# Altium project PCB_EctoPortal.PrjPcb
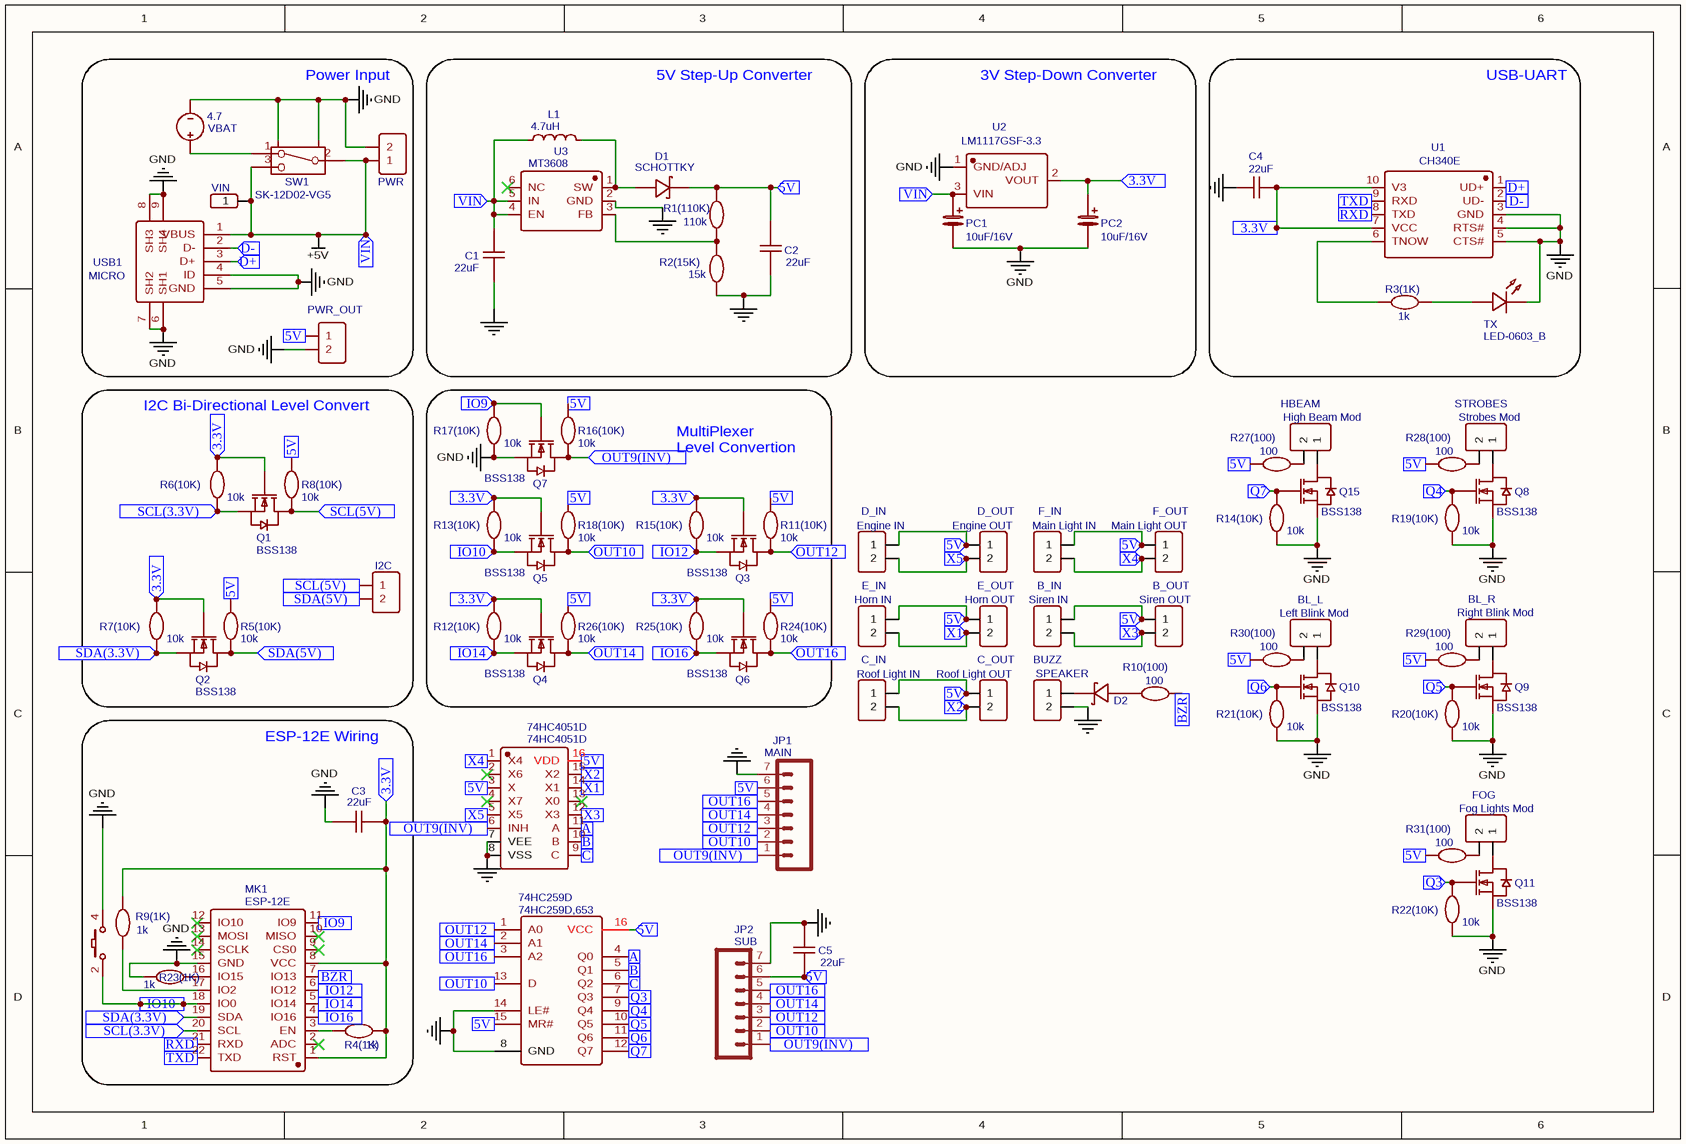
[diagram p0: PowerMod-ESP_2022-10-05.schdoc]
1 sheet, 86 parts. Net scope: flat (ports and power ports of the same name join across sheets).
Board file: 1-PCB_PCB_Ecto-1.pcbdoc

## Sheet PowerMod-ESP_2022-10-05.schdoc
size 315 x 213 mm; SheetNumber: 1; SheetTotal: 1

### Parts
74HC259D  74HC259D,653  [SOIC-16_L9.9-W3.9-P1.27-LS6.0-BL]
74HC4051D  74HC4051D  [SOIC-16_L9.9-W3.9-P1.27-LS6.0-BL]
B_IN  Siren IN  [JST_1.25MM_2P_SMD]
B_OUT  Siren OUT  [HDR-F-2.54_1X2]
BL_L  Left Blink Mod  [JST_1.25MM_2P_SMD]
BL_R  Right Blink Mod  [JST_1.25MM_2P_SMD]
BUZZ  SPEAKER  [HDR-F-2.54_1X2]
C1  22uF  [0805]
C2  22uF  [0805]
C3  22uF  [0805]
C4  22uF  [0805]
C5  22uF  [0805]
C_IN  Roof Light IN  [JST_1.25MM_2P_SMD]
C_OUT  Roof Light OUT  [HDR-F-2.54_1X2]
D1  SCHOTTKY  [SOD-123]
D2  SCTK  [SOD-123]  (value not drawn)
D_IN  Engine IN  [JST_1.25MM_2P_SMD]
D_OUT  Engine OUT  [HDR-F-2.54_1X2]
E_IN  Horn IN  [JST_1.25MM_2P_SMD]
E_OUT  Horn OUT  [HDR-F-2.54_1X2]
F_IN  Main Light IN  [JST_1.25MM_2P_SMD]
F_OUT  Main Light OUT  [HDR-F-2.54_1X2]
FLASH  K2-3.6×6.1_SMD  [SW-SMD_4P-L5.2-W5.2-P3.70-LS6.5]  (value not drawn)
FOG  Fog Lights Mod  [JST_1.25MM_2P_SMD]
HBEAM  High Beam Mod  [JST_1.25MM_2P_SMD]
I2C  HDR-F-2.54_1x2  [HDR-M-2.54_1X2]  (value not drawn)
JP1  MAIN  [1X07]
JP2  SUB  [JST_GH_SM07B-GHS-TB_07X1.25MM_ANGLED]
L1  4.7uH  [FXL0420]
MK1  ESP-12E  [WIFIM-SMD_ESP-12E]
PC1  10uF/16V  [CASE-A_3216]
PC2  10uF/16V  [CASE-A_3216]
PWR  HDR-F-2.54_1x2  [JST_1.25MM_2P_SMD]  (value not drawn)
PWR_OUT  HDR-F-2.54_1x2  [HDR-M-2.54_1X2]  (value not drawn)
Q1  BSS138  [SOT-23-3_L2.9-W1.6-P1.90-LS2.8-BR]
Q2  BSS138  [SOT-23-3_L2.9-W1.6-P1.90-LS2.8-BR]
Q3  BSS138  [SOT-23-3_L2.9-W1.6-P1.90-LS2.8-BR]
Q4  BSS138  [SOT-23-3_L2.9-W1.6-P1.90-LS2.8-BR]
Q5  BSS138  [SOT-23-3_L2.9-W1.6-P1.90-LS2.8-BR]
Q6  BSS138  [SOT-23-3_L2.9-W1.6-P1.90-LS2.8-BR]
Q7  BSS138  [SOT-23-3_L2.9-W1.6-P1.90-LS2.8-BR]
Q8  BSS138  [SOT-23-3_L2.9-W1.6-P1.90-LS2.8-BR]
Q9  BSS138  [SOT-23-3_L2.9-W1.6-P1.90-LS2.8-BR]
Q10  BSS138  [SOT-23-3_L2.9-W1.6-P1.90-LS2.8-BR]
Q11  BSS138  [SOT-23-3_L2.9-W1.6-P1.90-LS2.8-BR]
Q15  BSS138  [SOT-23-3_L2.9-W1.6-P1.90-LS2.8-BR]
R1(110K)  110k  [R0603]
R2(15K)  15k  [R0603]
R3(1K)  1k  [R0603]
R4(1K)  1k  [R0603]
R5(10K)  10k  [R0603]
R6(10K)  10k  [R0603]
R7(10K)  10k  [R0603]
R8(10K)  10k  [R0603]
R9(1K)  1k  [R0603]
R10(100)  100  [R0603]
R11(10K)  10k  [R0603]
R12(10K)  10k  [R0603]
R13(10K)  10k  [R0603]
R14(10K)  10k  [R0603]
R15(10K)  10k  [R0603]
R16(10K)  10k  [R0603]
R17(10K)  10k  [R0603]
R18(10K)  10k  [R0603]
R19(10K)  10k  [R0603]
R20(10K)  10k  [R0603]
R21(10K)  10k  [R0603]
R22(10K)  10k  [R0603]
R23(1K)  1k  [R0603]
R24(10K)  10k  [R0603]
R25(10K)  10k  [R0603]
R26(10K)  10k  [R0603]
R27(100)  100  [R0603]
R28(100)  100  [R0603]
R29(100)  100  [R0603]
R30(100)  100  [R0603]
R31(100)  100  [R0603]
STROBES  Strobes Mod  [JST_1.25MM_2P_SMD]
SW1  SK-12D02-VG5  [SW-TH_SK-12D02VG3]
TX  LED-0603_B  [LED0603_BLUE]
U1  CH340E  [MSOP-10_L3.0-W3.0-P0.50-LS5.0-BL]
U2  LM1117GSF-3.3  [SOT-223-3_L6.5-W3.4-P2.30-LS7.0-BR]
U3  MT3608  [SOT-23-6]
USB1  MICRO  [MICRO-USB-SMD_MICROXNJ]
VBAT  4.7  [JST_SH_SM02B-SRSS-TB_02X1.00MM_ANGLED]
VIN  HDR-M-2.54_1x1  [HDR-M-2.54_1X1]  (value not drawn)

### Blocks framed on the sheet
Power Input: PWR PWR_OUT SW1 USB1 VBAT VIN
5V Step-Up Converter: C1 C2 D1 L1 R1(110K) R2(15K) U3
3V Step-Down Converter: PC1 PC2 U2
USB-UART: C4 R3(1K) TX U1
I2C Bi-Directional Level Convert: I2C Q1 Q2 R5(10K) R6(10K) R7(10K) R8(10K)
ESP-12E Wiring: C3 FLASH MK1 R4(1K) R9(1K) R23(1K)

### Ports
3.3V (in, see PowerMod-ESP_2022-10-05[1B], PowerMod-ESP_2022-10-05[1C], PowerMod-ESP_2022-10-05[2B], PowerMod-ESP_2022-10-05[2C], PowerMod-ESP_2022-10-05[3B], PowerMod-ESP_2022-10-05[3C], PowerMod-ESP_2022-10-05[4A]), 3.3V (in, see PowerMod-ESP_2022-10-05[1B], PowerMod-ESP_2022-10-05[1C], PowerMod-ESP_2022-10-05[2B], PowerMod-ESP_2022-10-05[2C], PowerMod-ESP_2022-10-05[3B], PowerMod-ESP_2022-10-05[3C], PowerMod-ESP_2022-10-05[4A], PowerMod-ESP_2022-10-05[5A]), 3.3V (in, see PowerMod-ESP_2022-10-05[1B], PowerMod-ESP_2022-10-05[1C], PowerMod-ESP_2022-10-05[2B], PowerMod-ESP_2022-10-05[2C], PowerMod-ESP_2022-10-05[3B], PowerMod-ESP_2022-10-05[3C], PowerMod-ESP_2022-10-05[5A]), 3.3V (in, see PowerMod-ESP_2022-10-05[1B], PowerMod-ESP_2022-10-05[1C], PowerMod-ESP_2022-10-05[2B], PowerMod-ESP_2022-10-05[2C], PowerMod-ESP_2022-10-05[3B], PowerMod-ESP_2022-10-05[4A], PowerMod-ESP_2022-10-05[5A]), 3.3V (in, see PowerMod-ESP_2022-10-05[1B], PowerMod-ESP_2022-10-05[1C], PowerMod-ESP_2022-10-05[2B], PowerMod-ESP_2022-10-05[2C], PowerMod-ESP_2022-10-05[3C], PowerMod-ESP_2022-10-05[4A], PowerMod-ESP_2022-10-05[5A]), 3.3V (in, see PowerMod-ESP_2022-10-05[1B], PowerMod-ESP_2022-10-05[1C], PowerMod-ESP_2022-10-05[2C], PowerMod-ESP_2022-10-05[3B], PowerMod-ESP_2022-10-05[3C], PowerMod-ESP_2022-10-05[4A], PowerMod-ESP_2022-10-05[5A]), 3.3V (in, see PowerMod-ESP_2022-10-05[1B], PowerMod-ESP_2022-10-05[2B], PowerMod-ESP_2022-10-05[2C], PowerMod-ESP_2022-10-05[3B], PowerMod-ESP_2022-10-05[3C], PowerMod-ESP_2022-10-05[4A], PowerMod-ESP_2022-10-05[5A]), 3.3V (in, see PowerMod-ESP_2022-10-05[1C], PowerMod-ESP_2022-10-05[2B], PowerMod-ESP_2022-10-05[2C], PowerMod-ESP_2022-10-05[3B], PowerMod-ESP_2022-10-05[3C], PowerMod-ESP_2022-10-05[4A], PowerMod-ESP_2022-10-05[5A]), 5V (in, see PowerMod-ESP_2022-10-05[1B], PowerMod-ESP_2022-10-05[1C], PowerMod-ESP_2022-10-05[2B], PowerMod-ESP_2022-10-05[2C], PowerMod-ESP_2022-10-05[2D], PowerMod-ESP_2022-10-05[3A], PowerMod-ESP_2022-10-05[3B], PowerMod-ESP_2022-10-05[3C], PowerMod-ESP_2022-10-05[3D], PowerMod-ESP_2022-10-05[4B], PowerMod-ESP_2022-10-05[4C], PowerMod-ESP_2022-10-05[5B], PowerMod-ESP_2022-10-05[5C], PowerMod-ESP_2022-10-05[6B], PowerMod-ESP_2022-10-05[6C]), 5V (in, see PowerMod-ESP_2022-10-05[1B], PowerMod-ESP_2022-10-05[1C], PowerMod-ESP_2022-10-05[2B], PowerMod-ESP_2022-10-05[2C], PowerMod-ESP_2022-10-05[2D], PowerMod-ESP_2022-10-05[3A], PowerMod-ESP_2022-10-05[3B], PowerMod-ESP_2022-10-05[3C], PowerMod-ESP_2022-10-05[3D], PowerMod-ESP_2022-10-05[4B], PowerMod-ESP_2022-10-05[4C], PowerMod-ESP_2022-10-05[5B], PowerMod-ESP_2022-10-05[5C], PowerMod-ESP_2022-10-05[6B], PowerMod-ESP_2022-10-05[6C], PowerMod-ESP_2022-10-05[6D]), 5V (in, see PowerMod-ESP_2022-10-05[1B], PowerMod-ESP_2022-10-05[1C], PowerMod-ESP_2022-10-05[2B], PowerMod-ESP_2022-10-05[2C], PowerMod-ESP_2022-10-05[2D], PowerMod-ESP_2022-10-05[3A], PowerMod-ESP_2022-10-05[3B], PowerMod-ESP_2022-10-05[3C], PowerMod-ESP_2022-10-05[3D], PowerMod-ESP_2022-10-05[4B], PowerMod-ESP_2022-10-05[4C], PowerMod-ESP_2022-10-05[5B], PowerMod-ESP_2022-10-05[5C], PowerMod-ESP_2022-10-05[6B], PowerMod-ESP_2022-10-05[6D]), 5V (in, see PowerMod-ESP_2022-10-05[1B], PowerMod-ESP_2022-10-05[1C], PowerMod-ESP_2022-10-05[2B], PowerMod-ESP_2022-10-05[2C], PowerMod-ESP_2022-10-05[2D], PowerMod-ESP_2022-10-05[3A], PowerMod-ESP_2022-10-05[3B], PowerMod-ESP_2022-10-05[3C], PowerMod-ESP_2022-10-05[3D], PowerMod-ESP_2022-10-05[4B], PowerMod-ESP_2022-10-05[4C], PowerMod-ESP_2022-10-05[5B], PowerMod-ESP_2022-10-05[5C], PowerMod-ESP_2022-10-05[6C], PowerMod-ESP_2022-10-05[6D]), 5V (in, see PowerMod-ESP_2022-10-05[1B], PowerMod-ESP_2022-10-05[1C], PowerMod-ESP_2022-10-05[2B], PowerMod-ESP_2022-10-05[2C], PowerMod-ESP_2022-10-05[2D], PowerMod-ESP_2022-10-05[3A], PowerMod-ESP_2022-10-05[3B], PowerMod-ESP_2022-10-05[3C], PowerMod-ESP_2022-10-05[3D], PowerMod-ESP_2022-10-05[4B], PowerMod-ESP_2022-10-05[4C], PowerMod-ESP_2022-10-05[5B], PowerMod-ESP_2022-10-05[6B], PowerMod-ESP_2022-10-05[6C], PowerMod-ESP_2022-10-05[6D]), 5V (in, see PowerMod-ESP_2022-10-05[1B], PowerMod-ESP_2022-10-05[1C], PowerMod-ESP_2022-10-05[2B], PowerMod-ESP_2022-10-05[2C], PowerMod-ESP_2022-10-05[2D], PowerMod-ESP_2022-10-05[3A], PowerMod-ESP_2022-10-05[3B], PowerMod-ESP_2022-10-05[3C], PowerMod-ESP_2022-10-05[3D], PowerMod-ESP_2022-10-05[4B], PowerMod-ESP_2022-10-05[4C], PowerMod-ESP_2022-10-05[5C], PowerMod-ESP_2022-10-05[6B], PowerMod-ESP_2022-10-05[6C], PowerMod-ESP_2022-10-05[6D]), 5V (in, see PowerMod-ESP_2022-10-05[1B], PowerMod-ESP_2022-10-05[1C], PowerMod-ESP_2022-10-05[2B], PowerMod-ESP_2022-10-05[2C], PowerMod-ESP_2022-10-05[2D], PowerMod-ESP_2022-10-05[3B], PowerMod-ESP_2022-10-05[3C], PowerMod-ESP_2022-10-05[3D], PowerMod-ESP_2022-10-05[4B], PowerMod-ESP_2022-10-05[4C], PowerMod-ESP_2022-10-05[5B], PowerMod-ESP_2022-10-05[5C], PowerMod-ESP_2022-10-05[6B], PowerMod-ESP_2022-10-05[6C], PowerMod-ESP_2022-10-05[6D]), 5V (in, see PowerMod-ESP_2022-10-05[1B], PowerMod-ESP_2022-10-05[1C], PowerMod-ESP_2022-10-05[2B], PowerMod-ESP_2022-10-05[2C], PowerMod-ESP_2022-10-05[3A], PowerMod-ESP_2022-10-05[3B], PowerMod-ESP_2022-10-05[3C], PowerMod-ESP_2022-10-05[3D], PowerMod-ESP_2022-10-05[4B], PowerMod-ESP_2022-10-05[4C], PowerMod-ESP_2022-10-05[5B], PowerMod-ESP_2022-10-05[5C], PowerMod-ESP_2022-10-05[6B], PowerMod-ESP_2022-10-05[6C], PowerMod-ESP_2022-10-05[6D]), 5V (in, see PowerMod-ESP_2022-10-05[1B], PowerMod-ESP_2022-10-05[1C], PowerMod-ESP_2022-10-05[2B], PowerMod-ESP_2022-10-05[2D], PowerMod-ESP_2022-10-05[3A], PowerMod-ESP_2022-10-05[3B], PowerMod-ESP_2022-10-05[3C], PowerMod-ESP_2022-10-05[3D], PowerMod-ESP_2022-10-05[4B], PowerMod-ESP_2022-10-05[4C], PowerMod-ESP_2022-10-05[5B], PowerMod-ESP_2022-10-05[5C], PowerMod-ESP_2022-10-05[6B], PowerMod-ESP_2022-10-05[6C], PowerMod-ESP_2022-10-05[6D]), 5V (in, see PowerMod-ESP_2022-10-05[1B], PowerMod-ESP_2022-10-05[1C], PowerMod-ESP_2022-10-05[2C], PowerMod-ESP_2022-10-05[2D], PowerMod-ESP_2022-10-05[3A], PowerMod-ESP_2022-10-05[3B], PowerMod-ESP_2022-10-05[3C], PowerMod-ESP_2022-10-05[3D], PowerMod-ESP_2022-10-05[4B], PowerMod-ESP_2022-10-05[4C], PowerMod-ESP_2022-10-05[5B], PowerMod-ESP_2022-10-05[5C], PowerMod-ESP_2022-10-05[6B], PowerMod-ESP_2022-10-05[6C], PowerMod-ESP_2022-10-05[6D]), 5V (in, see PowerMod-ESP_2022-10-05[1B], PowerMod-ESP_2022-10-05[2B], PowerMod-ESP_2022-10-05[2C], PowerMod-ESP_2022-10-05[2D], PowerMod-ESP_2022-10-05[3A], PowerMod-ESP_2022-10-05[3B], PowerMod-ESP_2022-10-05[3C], PowerMod-ESP_2022-10-05[3D], PowerMod-ESP_2022-10-05[4B], PowerMod-ESP_2022-10-05[4C], PowerMod-ESP_2022-10-05[5B], PowerMod-ESP_2022-10-05[5C], PowerMod-ESP_2022-10-05[6B], PowerMod-ESP_2022-10-05[6C], PowerMod-ESP_2022-10-05[6D]), 5V (in, see PowerMod-ESP_2022-10-05[1C], PowerMod-ESP_2022-10-05[2B], PowerMod-ESP_2022-10-05[2C], PowerMod-ESP_2022-10-05[2D], PowerMod-ESP_2022-10-05[3A], PowerMod-ESP_2022-10-05[3B], PowerMod-ESP_2022-10-05[3C], PowerMod-ESP_2022-10-05[3D], PowerMod-ESP_2022-10-05[4B], PowerMod-ESP_2022-10-05[4C], PowerMod-ESP_2022-10-05[5B], PowerMod-ESP_2022-10-05[5C], PowerMod-ESP_2022-10-05[6B], PowerMod-ESP_2022-10-05[6C], PowerMod-ESP_2022-10-05[6D]), A (in, see PowerMod-ESP_2022-10-05[3C]), A (in, see PowerMod-ESP_2022-10-05[3D]), B (in, see PowerMod-ESP_2022-10-05[3C]), B (in, see PowerMod-ESP_2022-10-05[3D]), BZR (in, see PowerMod-ESP_2022-10-05[2D]), BZR (in, see PowerMod-ESP_2022-10-05[5C]), C (in, see PowerMod-ESP_2022-10-05[3D]), D+ (in, see PowerMod-ESP_2022-10-05[1A]), D+ (in, see PowerMod-ESP_2022-10-05[6A]), D- (in, see PowerMod-ESP_2022-10-05[1A]), D- (in, see PowerMod-ESP_2022-10-05[6A]), IO9 (in, see PowerMod-ESP_2022-10-05[2B]), IO9 (in, see PowerMod-ESP_2022-10-05[2D]), IO10 (in), IO10 (in, see PowerMod-ESP_2022-10-05[2B]), IO12 (in, see PowerMod-ESP_2022-10-05[2D]), IO12 (in, see PowerMod-ESP_2022-10-05[3B]), IO14 (in, see PowerMod-ESP_2022-10-05[2C]), IO14 (in, see PowerMod-ESP_2022-10-05[2D]), IO16 (in, see PowerMod-ESP_2022-10-05[2D]), IO16 (in, see PowerMod-ESP_2022-10-05[3C]), OUT9(INV) (in, see PowerMod-ESP_2022-10-05[2C], PowerMod-ESP_2022-10-05[3B], PowerMod-ESP_2022-10-05[3D]), OUT9(INV) (in, see PowerMod-ESP_2022-10-05[2C], PowerMod-ESP_2022-10-05[3D]), OUT9(INV) (in, see PowerMod-ESP_2022-10-05[3B], PowerMod-ESP_2022-10-05[3D]), OUT10 (in, see PowerMod-ESP_2022-10-05[2D], PowerMod-ESP_2022-10-05[3B], PowerMod-ESP_2022-10-05[3C]), OUT10 (in, see PowerMod-ESP_2022-10-05[2D], PowerMod-ESP_2022-10-05[3B], PowerMod-ESP_2022-10-05[3D]), OUT10 (in, see PowerMod-ESP_2022-10-05[2D], PowerMod-ESP_2022-10-05[3C], PowerMod-ESP_2022-10-05[3D]), OUT10 (in, see PowerMod-ESP_2022-10-05[3B], PowerMod-ESP_2022-10-05[3C], PowerMod-ESP_2022-10-05[3D]), OUT12 (in, see PowerMod-ESP_2022-10-05[2D], PowerMod-ESP_2022-10-05[3B], PowerMod-ESP_2022-10-05[3C]), OUT12 (in, see PowerMod-ESP_2022-10-05[2D], PowerMod-ESP_2022-10-05[3B], PowerMod-ESP_2022-10-05[3D]), OUT12 (in, see PowerMod-ESP_2022-10-05[2D], PowerMod-ESP_2022-10-05[3C], PowerMod-ESP_2022-10-05[3D]), OUT12 (in, see PowerMod-ESP_2022-10-05[3B], PowerMod-ESP_2022-10-05[3C], PowerMod-ESP_2022-10-05[3D]), OUT14 (in, see PowerMod-ESP_2022-10-05[2D], PowerMod-ESP_2022-10-05[3C]), OUT14 (in, see PowerMod-ESP_2022-10-05[2D], PowerMod-ESP_2022-10-05[3C], PowerMod-ESP_2022-10-05[3D]), OUT14 (in, see PowerMod-ESP_2022-10-05[3C], PowerMod-ESP_2022-10-05[3D]), OUT16 (in, see PowerMod-ESP_2022-10-05[2D], PowerMod-ESP_2022-10-05[3C]), OUT16 (in, see PowerMod-ESP_2022-10-05[2D], PowerMod-ESP_2022-10-05[3C], PowerMod-ESP_2022-10-05[3D]), OUT16 (in, see PowerMod-ESP_2022-10-05[3C], PowerMod-ESP_2022-10-05[3D]), Q3 (in, see PowerMod-ESP_2022-10-05[3D]), Q3 (in, see PowerMod-ESP_2022-10-05[6D]), Q4 (in, see PowerMod-ESP_2022-10-05[3D]), Q4 (in, see PowerMod-ESP_2022-10-05[6B]), Q5 (in, see PowerMod-ESP_2022-10-05[3D]), Q5 (in, see PowerMod-ESP_2022-10-05[6C]), Q6 (in, see PowerMod-ESP_2022-10-05[3D]), Q6 (in, see PowerMod-ESP_2022-10-05[5C]), Q7 (in, see PowerMod-ESP_2022-10-05[3D]), Q7 (in, see PowerMod-ESP_2022-10-05[5B]), RXD (in), RXD (in, see PowerMod-ESP_2022-10-05[5A]), SCL(3.3V) (in), SCL(3.3V) (in, see PowerMod-ESP_2022-10-05[1B]), SCL(5V) (in, see PowerMod-ESP_2022-10-05[1C]), SCL(5V) (in, see PowerMod-ESP_2022-10-05[2B]), SDA(3.3V) (in), SDA(3.3V) (in, see PowerMod-ESP_2022-10-05[1C]), SDA(5V) (in, see PowerMod-ESP_2022-10-05[1C]), TXD (in), TXD (in, see PowerMod-ESP_2022-10-05[5A]), VIN (in, see PowerMod-ESP_2022-10-05[2A]), VIN (in, see PowerMod-ESP_2022-10-05[2A], PowerMod-ESP_2022-10-05[4A]), X1 (in, see PowerMod-ESP_2022-10-05[3C]), X1 (in, see PowerMod-ESP_2022-10-05[4C]), X2 (in, see PowerMod-ESP_2022-10-05[3C]), X2 (in, see PowerMod-ESP_2022-10-05[4C]), X3 (in, see PowerMod-ESP_2022-10-05[3C]), X3 (in, see PowerMod-ESP_2022-10-05[4C]), X4 (in, see PowerMod-ESP_2022-10-05[2C]), X4 (in, see PowerMod-ESP_2022-10-05[4B]), X5 (in, see PowerMod-ESP_2022-10-05[2C]), X5 (in, see PowerMod-ESP_2022-10-05[4B])

### Nets
+5V: C1.2 L1.2 PC1.1 PWR.1 SW1.2 SW1.3 U2.3(VIN) U3.4(EN) U3.5(IN) USB1.1(VBUS) VIN.1 ; port VIN
GND: 74HC259D.8(GND) 74HC259D.14(LE#) 74HC4051D.7(VEE) 74HC4051D.8(VSS) BUZZ.2 C1.1 C2.1 C3.1 C4.2 C5.1 FLASH.4 JP1.7 JP2.7 MK1.15(GND) PC1.2 PC2.2 PWR.2 PWR_OUT.2 Q7.2(S) Q8.2(S) Q9.2(S) Q10.2(S) Q11.2(S) Q15.2(S) R2(15K).2 R14(10K).2 R17(10K).2 R19(10K).2 R20(10K).2 R21(10K).2 R22(10K).2 R23(1K).2 SW1.4 SW1.5 TX.2 U1.3(GND) U1.4(RTS#) U1.5(CTS#) U2.1(GND/ADJ) U3.2(GND) USB1.4(ID) USB1.5(GND) USB1.6(SH1) USB1.7(SH2) USB1.8(SH3) USB1.9(SH4) VBAT.2
Net74HC259D_1: 74HC259D.1(A0) JP1.3 JP2.3 Q3.3(D) R11(10K).2 ; port OUT12
Net74HC259D_2: 74HC259D.2(A1) JP1.4 JP2.4 Q4.3(D) R26(10K).2 ; port OUT14
Net74HC259D_3: 74HC259D.3(A2) JP1.5 JP2.5 Q6.3(D) R24(10K).2 ; port OUT16
Net74HC259D_4: 74HC259D.4(Q0) 74HC4051D.11(A) ; port A
Net74HC259D_5: 74HC259D.5(Q1) 74HC4051D.10(B) ; port B
Net74HC259D_6: 74HC259D.6(Q2) 74HC4051D.9(C) ; port C
Net74HC259D_7: 74HC259D.7(Q3) Q11.1(G) R22(10K).1 ; port Q3
Net74HC259D_9: 74HC259D.9(Q4) Q8.1(G) R19(10K).1 ; port Q4
Net74HC259D_10: 74HC259D.10(Q5) Q9.1(G) R20(10K).1 ; port Q5
Net74HC259D_11: 74HC259D.11(Q6) Q10.1(G) R21(10K).1 ; port Q6
Net74HC259D_12: 74HC259D.12(Q7) Q15.1(G) R14(10K).1 ; port Q7
Net74HC259D_13: 74HC259D.13(D) JP1.2 JP2.2 Q5.3(D) R18(10K).2 ; port OUT10
Net74HC259D_15: 74HC259D.15(MR#) 74HC259D.16(VCC) 74HC4051D.3(X) 74HC4051D.16(VDD) B_IN.1 B_OUT.1 C2.2 C5.2 C_IN.1 C_OUT.1 D1.2(K) D_IN.1 D_OUT.1 E_IN.1 E_OUT.1 F_IN.1 F_OUT.1 JP1.6 JP2.6 PWR_OUT.1 R1(110K).1 R5(10K).1 R8(10K).1 R11(10K).1 R16(10K).1 R18(10K).1 R24(10K).1 R26(10K).1 R27(100).1 R28(100).1 R29(100).1 R30(100).1 R31(100).1 ; port 5V
Net74HC4051D_1: 74HC4051D.1(X4) F_IN.2 F_OUT.2 ; port X4
Net74HC4051D_5: 74HC4051D.5(X5) D_IN.2 D_OUT.2 ; port X5
Net74HC4051D_6: 74HC4051D.6(INH) JP1.1 JP2.1 Q7.3(D) R16(10K).2 ; port OUT9(INV)
Net74HC4051D_12: 74HC4051D.12(X3) B_IN.2 B_OUT.2 ; port X3
Net74HC4051D_14: 74HC4051D.14(X1) E_IN.2 E_OUT.2 ; port X1
Net74HC4051D_15: 74HC4051D.15(X2) C_IN.2 C_OUT.2 ; port X2
NetBL_L_1: BL_L.1 Q10.3(D)
NetBL_L_2: BL_L.2 R30(100).2
NetBL_R_1: BL_R.1 Q9.3(D)
NetBL_R_2: BL_R.2 R29(100).2
NetBUZZ_1: BUZZ.1 D2.2(K)
NetC3_2: C3.2 C4.1 MK1.1(RST) MK1.8(VCC) PC2.1 Q1.1(G) Q2.1(G) Q3.1(G) Q4.1(G) Q5.1(G) Q6.1(G) R4(1K).2 R6(10K).1 R7(10K).1 R9(1K).2 R12(10K).1 R13(10K).1 R15(10K).1 R25(10K).1 U1.7(VCC) U1.10(V3) U2.2(VOUT) ; port 3.3V
NetD1_1: D1.1(A) L1.1 U3.1(SW)
NetD2_1: D2.1(A) R10(100).1
NetFLASH_2: FLASH.2 MK1.18(IO0) Q5.2(S) R13(10K).2 ; port IO10
NetFOG_1: FOG.1 Q11.3(D)
NetFOG_2: FOG.2 R31(100).2
NetHBEAM_1: HBEAM.1 Q15.3(D)
NetHBEAM_2: HBEAM.2 R27(100).2
NetI2C_1: I2C.1 Q1.3(D) R8(10K).2 ; port SCL(5V)
NetI2C_2: I2C.2 Q2.3(D) R5(10K).2 ; port SDA(5V)
NetMK1_3: MK1.3(EN) R4(1K).1
NetMK1_4: MK1.4(IO16) Q6.2(S) R25(10K).2 ; port IO16
NetMK1_5: MK1.5(IO14) Q4.2(S) R12(10K).2 ; port IO14
NetMK1_6: MK1.6(IO12) Q3.2(S) R15(10K).2 ; port IO12
NetMK1_7: MK1.7(IO13) R10(100).2 ; port BZR
NetMK1_11: MK1.11(IO9) Q7.1(G) R17(10K).1 ; port IO9
NetMK1_16: MK1.16(IO15) R23(1K).1
NetMK1_17: MK1.17(IO2) R9(1K).1
NetMK1_19: MK1.19(SDA) Q2.2(S) R7(10K).2 ; port SDA(3.3V)
NetMK1_20: MK1.20(SCL) Q1.2(S) R6(10K).2 ; port SCL(3.3V)
NetMK1_21: MK1.21(RXD) U1.8(TXD) ; port RXD
NetMK1_22: MK1.22(TXD) U1.9(RXD) ; port TXD
NetQ8_3: Q8.3(D) STROBES.1
NetR1(110K)_2: R1(110K).2 R2(15K).1 U3.3(FB)
NetR3(1K)_1: R3(1K).1 U1.6(TNOW)
NetR3(1K)_2: R3(1K).2 TX.1
NetR28(100)_2: R28(100).2 STROBES.2
NetSW1_1: SW1.1 VBAT.1
NetU1_1: U1.1(UD+) USB1.3(D+) ; port D+
NetU1_2: U1.2(UD-) USB1.2(D-) ; port D-

Not connected (* = marked no-connect by the designer): 74HC4051D 2(X6)* 4(X7)* 13(X0)*; MK1 2(ADC)* 9(CS0)* 10(MISO)* 12(IO10)* 13(MOSI)* 14(SCLK)*; U3 6(NC)*

### Notes on the sheet
- MultiPlexer
  Level Convertion

### Library data of the parts
74HC259D = 74HC259D,653: BOM_Manufacturer: Nexperia; BOM_Supplier: LCSC; BOM_Manufacturer Part: 74HC259D,653; BOM_Supplier Part: C132670; BOM_JLCPCB Part Class: Extended Part; spicePre: U; spiceSymbolName: 74HC259D,653
74HC4051D = 74HC4051D: BOM_Manufacturer: TOSHIBA(东芝); Contributor: LCSC; BOM_Supplier: LCSC; BOM_Supplier Part: C2673644; BOM_Manufacturer Part: 74HC4051D; spicePre: U; spiceSymbolName: 74HC4051D
B_IN = Siren IN: Contributor: LCEDA_Lib; Package Display: No; BOM_Supplier Part: C49661; BOM_Supplier: LCSC; spicePre: H; spiceSymbolName: HDR-F-2.54_1x2
B_OUT = Siren OUT: Contributor: LCEDA_Lib; Package Display: No; BOM_Supplier Part: C49661; BOM_Supplier: LCSC; spicePre: H; spiceSymbolName: HDR-F-2.54_1x2
BL_L = Left Blink Mod: Contributor: LCEDA_Lib; Package Display: No; BOM_Supplier Part: C49661; BOM_Supplier: LCSC; spicePre: H; spiceSymbolName: HDR-F-2.54_1x2
BL_R = Right Blink Mod: Contributor: LCEDA_Lib; Package Display: No; BOM_Supplier Part: C49661; BOM_Supplier: LCSC; spicePre: H; spiceSymbolName: HDR-F-2.54_1x2
BUZZ = SPEAKER: Contributor: LCEDA_Lib; BOM_Supplier Part: C49661; BOM_Supplier: LCSC; spicePre: H; spiceSymbolName: HDR-F-2.54_1x2
C1-C3 C5 = 22uF: BOM_Manufacturer Part: 1206X226K100; BOM_Manufacturer: WTC; nameAlias: Value(F); Package Display: No; spicePre: C; spiceSymbolName: Cap_0603_US; BOM_Supplier: LCSC; BOM_Supplier Part: C123665
C4 = 22uF: BOM_Manufacturer: EYANG; BOM_Manufacturer Part: C0402C0GR75C500NTB; nameAlias: Capacitance; Contributor: LCSC; Package Display: No; BOM_Supplier: LCSC; BOM_Supplier Part: C115651; spicePre: C; spiceSymbolName: C0402C0GR75C500NTB
C_IN = Roof Light IN: Contributor: LCEDA_Lib; Package Display: No; BOM_Supplier Part: C49661; BOM_Supplier: LCSC; spicePre: H; spiceSymbolName: HDR-F-2.54_1x2
C_OUT = Roof Light OUT: Contributor: LCEDA_Lib; Package Display: No; BOM_Supplier Part: C49661; BOM_Supplier: LCSC; spicePre: H; spiceSymbolName: HDR-F-2.54_1x2
D1 = SCHOTTKY: BOM_Manufacturer: ON; BOM_Manufacturer Part: MBR0520LT1G; BOM_Supplier Part: C23848; BOM_Supplier: LCSC; image: //image.lceda.cn/szlcsc/C23848.jpg; spicePre: D
D2 = SCTK: BOM_Manufacturer: ON; BOM_Manufacturer Part: MBR0520LT1G; BOM_Supplier Part: C23848; BOM_Supplier: LCSC; image: //image.lceda.cn/szlcsc/C23848.jpg; spicePre: D
D_IN = Engine IN: Contributor: LCEDA_Lib; Package Display: No; BOM_Supplier Part: C49661; BOM_Supplier: LCSC; spicePre: H; spiceSymbolName: HDR-F-2.54_1x2
D_OUT = Engine OUT: Contributor: LCEDA_Lib; Package Display: No; BOM_Supplier Part: C49661; BOM_Supplier: LCSC; spicePre: H; spiceSymbolName: HDR-F-2.54_1x2
E_IN = Horn IN: Contributor: LCEDA_Lib; Package Display: No; BOM_Supplier Part: C49661; BOM_Supplier: LCSC; spicePre: H; spiceSymbolName: HDR-F-2.54_1x2
E_OUT = Horn OUT: Contributor: LCEDA_Lib; Package Display: No; BOM_Supplier Part: C49661; BOM_Supplier: LCSC; spicePre: H; spiceSymbolName: HDR-F-2.54_1x2
F_IN = Main Light IN: Contributor: LCEDA_Lib; Package Display: No; BOM_Supplier Part: C49661; BOM_Supplier: LCSC; spicePre: H; spiceSymbolName: HDR-F-2.54_1x2
F_OUT = Main Light OUT: Contributor: LCEDA_Lib; Package Display: No; BOM_Supplier Part: C49661; BOM_Supplier: LCSC; spicePre: H; spiceSymbolName: HDR-F-2.54_1x2
FLASH = K2-3.6×6.1_SMD: BOM_Manufacturer Part: K2-1107ST-A4SW-06; Contributor: LCEDA_Lib; 制造商: 韩国韩荣; Package Display: No; BOM_Supplier Part: C118141; BOM_Supplier: LCSC; spicePre: K; spiceSymbolName: K2-3.6×6.1_SMD
FOG = Fog Lights Mod: Contributor: LCEDA_Lib; Package Display: No; BOM_Supplier Part: C49661; BOM_Supplier: LCSC; spicePre: H; spiceSymbolName: HDR-F-2.54_1x2
HBEAM = High Beam Mod: Contributor: LCEDA_Lib; Package Display: No; BOM_Supplier Part: C49661; BOM_Supplier: LCSC; spicePre: H; spiceSymbolName: HDR-F-2.54_1x2
I2C = HDR-F-2.54_1x2: Contributor: LCEDA_Lib; BOM_Supplier Part: C49661; BOM_Supplier: LCSC; spicePre: H; spiceSymbolName: HDR-F-2.54_1x2
JP1 = MAIN: Contributor: SparkFun; spicePre: J; spiceSymbolName: M07
JP2 = SUB: Contributor: SparkFun; Package Display: No; spicePre: J; spiceSymbolName: M07
L1 = 4.7uH: BOM_Manufacturer Part: FXL0420-4R7-M; BOM_Manufacturer: cjiang; nameAlias: Value(H); spicePre: L; spiceSymbolName: Inductor_0603_US; BOM_Supplier: LCSC; BOM_Supplier Part: C167208
MK1 = ESP-12E: BOM_Manufacturer: Ai-Thinker; BOM_Supplier: LCSC; BOM_Manufacturer Part: ESP-12E; BOM_Supplier Part: C89297; spicePre: M; spiceSymbolName: ESP-12E
PC1 = 10uF/16V: nameAlias: Value(F); Package Display: No; BOM_Manufacturer Part: ?; spicePre: C; spiceSymbolName: Capacitor
PC2 = 10uF/16V: nameAlias: Value(F); BOM_Manufacturer Part: ?; spicePre: C; spiceSymbolName: Capacitor
PWR PWR_OUT = HDR-F-2.54_1x2: Contributor: LCEDA_Lib; Package Display: No; BOM_Supplier Part: C49661; BOM_Supplier: LCSC; spicePre: H; spiceSymbolName: HDR-F-2.54_1x2
Q1-Q11 Q15 = BSS138: BOM_Manufacturer: ON; BOM_Manufacturer Part: BSS138LT1G; SMT Type: Extend; BOM_Paste Type: recommend; BOM_Supplier: LCSC; BOM_Supplier Part: C82045; BOM_JLCPCB SMD: Yes; spicePre: Q; spiceSymbolName: BSS138LT1G
R1(110K) = 110k: nameAlias: Value(Ω); Contributor: LCEDA_Lib; spicePre: R; spiceSymbolName: R_0603_EU
R2(15K) = 15k: nameAlias: Value(Ω); Contributor: LCEDA_Lib; spicePre: R; spiceSymbolName: R_0603_EU
R3(1K) R4(1K) R9(1K) R23(1K) = 1k: nameAlias: Value(Ω); Contributor: LCEDA_Lib; spicePre: R; spiceSymbolName: R_0603_EU
R5(10K) R6(10K) R7(10K) R8(10K) R11(10K) R12(10K) R13(10K) R14(10K) R15(10K) R16(10K) R17(10K) R18(10K) R19(10K) R20(10K) R21(10K) R22(10K) R24(10K) R25(10K) R26(10K) = 10k: nameAlias: Value(Ω); Contributor: LCEDA_Lib; spicePre: R; spiceSymbolName: R_0603_EU
R10(100) R27(100) R28(100) R29(100) R30(100) R31(100) = 100: nameAlias: Value(Ω); Contributor: LCEDA_Lib; spicePre: R; spiceSymbolName: R_0603_EU
STROBES = Strobes Mod: Contributor: LCEDA_Lib; Package Display: No; BOM_Supplier Part: C49661; BOM_Supplier: LCSC; spicePre: H; spiceSymbolName: HDR-F-2.54_1x2
SW1 = SK-12D02-VG5: BOM_Manufacturer: Rectangular Connectors - Contacts; Contributor: LCSC; Package Display: No; BOM_Supplier: LCSC; BOM_Supplier Part: C136722; BOM_Manufacturer Part: SK-12D02-VG5; spicePre: S; spiceSymbolName: SK-12D02-VG5
TX = LED-0603_B: BOM_Manufacturer: EVERLIGHT(台湾亿光); BOM_Manufacturer Part: 19-217/BHC-ZL1M2RY/3T; Contributor: LCEDA_01; BOM_Supplier Part: C72041; BOM_Supplier: LCSC; spicePre: L; spiceSymbolName: LED-0603_B
U1 = CH340E: BOM_Manufacturer: WCH; SMT Type: Extend; BOM_Paste Type: recommend; BOM_Supplier: LCSC; BOM_Manufacturer Part: CH340E; BOM_Supplier Part: C99652; BOM_JLCPCB SMD: Yes; spicePre: U; spiceSymbolName: CH340E
U2 = LM1117GSF-3.3: BOM_Manufacturer: HTC Korea TAEJIN Tech; Contributor: LCSC; BOM_Paste Type: expand; Package Display: No; BOM_Supplier: LCSC; BOM_Supplier Part: C481677; BOM_Manufacturer Part: LM1117GSF-3.3; spicePre: U; spiceSymbolName: LM1117GSF-3.3
U3 = MT3608: BOM_Manufacturer: AEROSEMI; Contributor: LCSC; BOM_Supplier: LCSC; BOM_Manufacturer Part: MT3608; BOM_Supplier Part: C84817; spicePre: U
USB1 = MICRO: BOM_Manufacturer: SHOU HAN; BOM_Manufacturer Part: MicroXNJ; Contributor: LCSC; BOM_Paste Type: expand; BOM_Supplier: LCSC; BOM_Supplier Part: C404969; spicePre: U; spiceSymbolName: MICROXNJ
VBAT = 4.7: nameAlias: Value; Contributor: EasyEDA; sim: true; Package Display: No; spiceSymbolName: VDC; spicePre: V
VIN = HDR-M-2.54_1x1: Contributor: LCEDA_Lib; Package Display: No; BOM_Supplier Part: C81276; BOM_Supplier: LCSC; spicePre: J; spiceSymbolName: HDR-M-2.54_1x1